# EAGLE design Othermill PCB Trace Test (EAGLE 7.6.0)
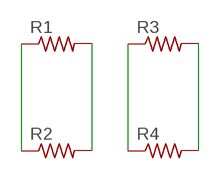
[diagram p0: schematic, sheet 1]

## Parts
R1  R-US_0204/2V  [0204V]
R2  R-US_0204/2V  [0204V]
R3  R-US_0204/2V  [0204V]
R4  R-US_0204/2V  [0204V]

## Nets
N$1: R1.1 R2.1
N$2: R1.2 R2.2
N$3: R3.1 R4.1
N$4: R3.2 R4.2

## Library data of the parts
R1-R4 = resistor:R-US_: RESISTOR, American symbol

## Board
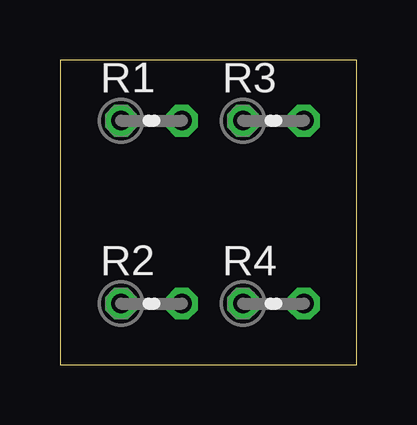
[diagram p1: board, top side]
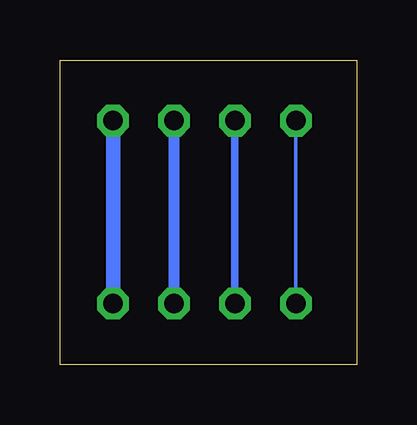
[diagram p2: board, bottom side, seen from below]

Size 12.37 x 12.69 mm. Coordinates in mm from the lower left corner, seen from the top.
Outline: 0,0 12.37,0 12.37,12.69 0,12.69 0,0
Copper layers (1*16): Top 0.035mm / dielectric 1.5mm / Bottom 0.035mm
Design rules "default": minimum track width 10mil, minimum drill 24mil, track to track 8mil, track to pad 8mil, pad to pad 8mil, via to via 8mil, smd to smd 8mil, copper to edge 40mil, drill to drill 8mil, minimum pad ring 10mil, minimum via ring 8mil, stop-mask expansion 4mil, vias tented up to drill 0mil, thermal gap 10mil

### Footprints (pad centres in the part's own frame; a part is rotated, then mirrored left to right if it is on the bottom)
0204V = drill 0.813 octagon: 1 -1.27,0; 2 1.27,0

### Placement (x,y rotation side)
R1  3.81,10.16 0 top
R2  3.81,2.54 0 top
R3  8.89,10.16 0 top
R4  8.89,2.54 0 top

### Tracks (layer width: path | path; a pad name or v marks a point on that pad's centre or on a via)
N$1
  Bottom 0.152: R1.1 R2.1
N$2
  Bottom 0.305: R1.2 R2.2
N$3
  Bottom 0.457: R3.1 R4.1
N$4
  Bottom 0.61: R3.2 R4.2